# Altium schematic sheet [02] - BLOCK DIAGRAM.SchDoc
size A3; DocumentNumber: 2; SheetNumber: 2; SheetTotal: 13
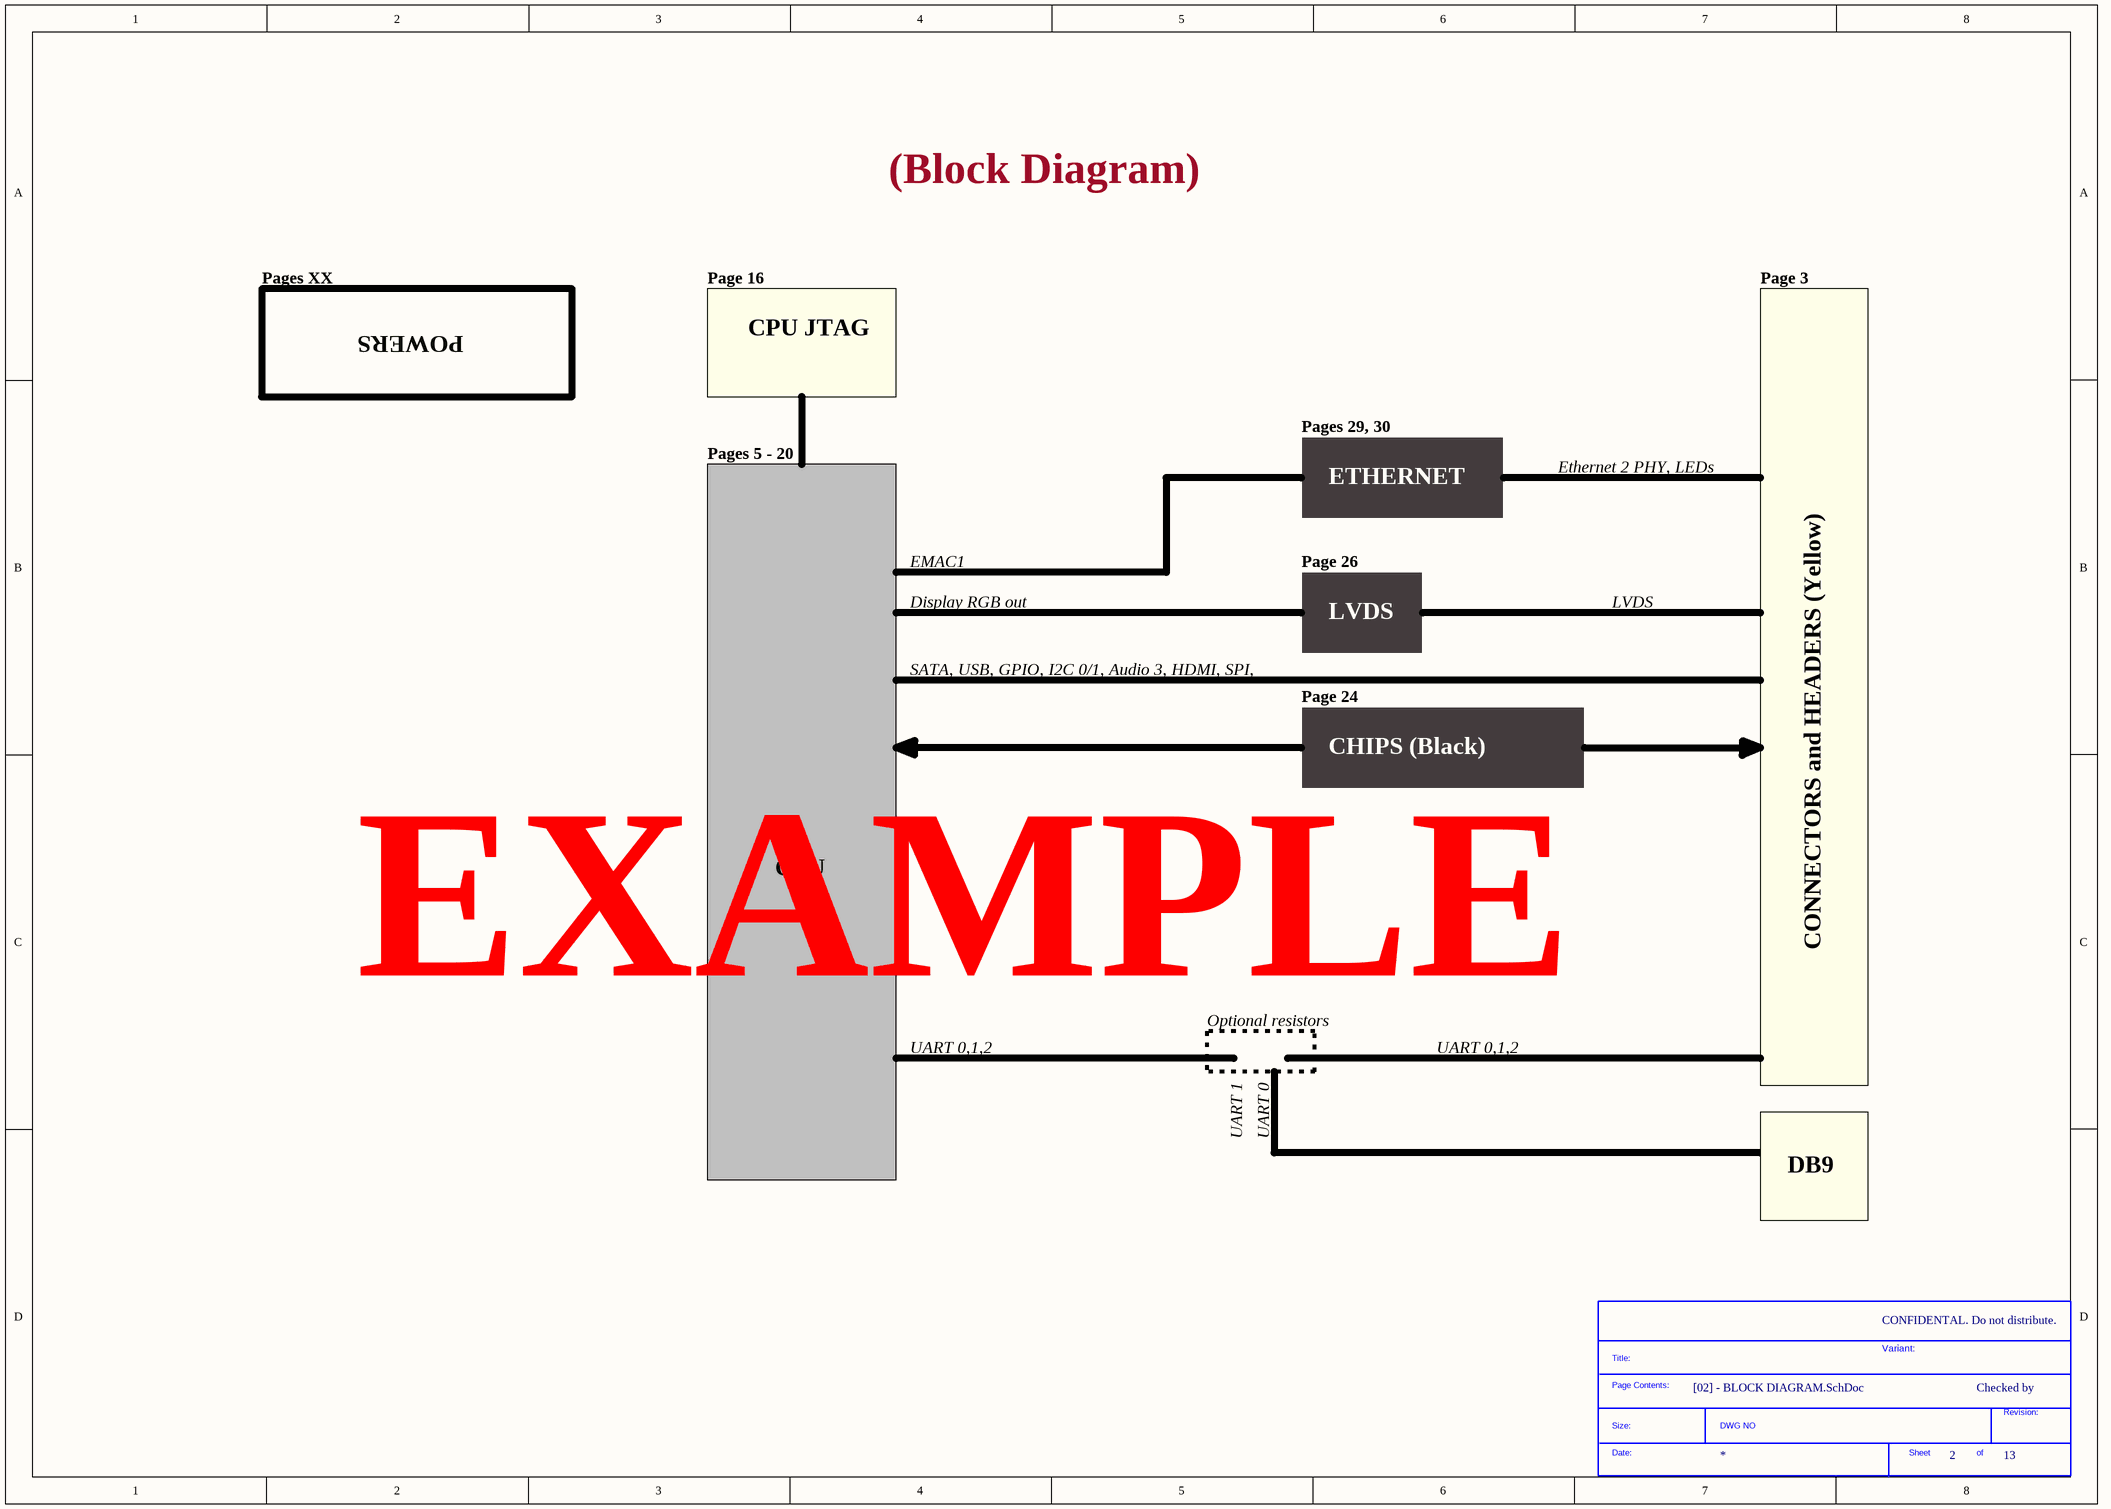
[diagram p0: [02] - BLOCK DIAGRAM.SchDoc]

## Parts
*  SDTitleBlock  (value not drawn)  (graphical)

## Notes on the sheet
- (Block Diagram)
- Pages XX
- Page 16
- Page 3
- POWERS
- CPU JTAG
- Pages 29, 30
- Pages 5 - 20
- ETHERNET
- Ethernet 2 PHY, LEDs
- EMAC1
- Page 26
- Display RGB out
- LVDS
- SATA, USB, GPIO, I2C 0/1, Audio 3, HDMI, SPI,
- Page 24
- CHIPS (Black)
- CPU
- CONNECTORS and HEADERS (Yellow)
- EXAMPLE
- UART 0,1,2
- Optional resistors
- FPGA
- UART 1
- UART 0
- DB9
- CONFIDENTAL. Do not distribute.
- CLOCKS (CPU & PCIE)
- Variant:
- Checked by
- (in symbol SDTitleBlock) Title:; Page Contents:; Revision:; Size:; DWG NO; Date:; Sheet; of